# Altium schematic sheet Control_Board_Control.SchDoc
size A3
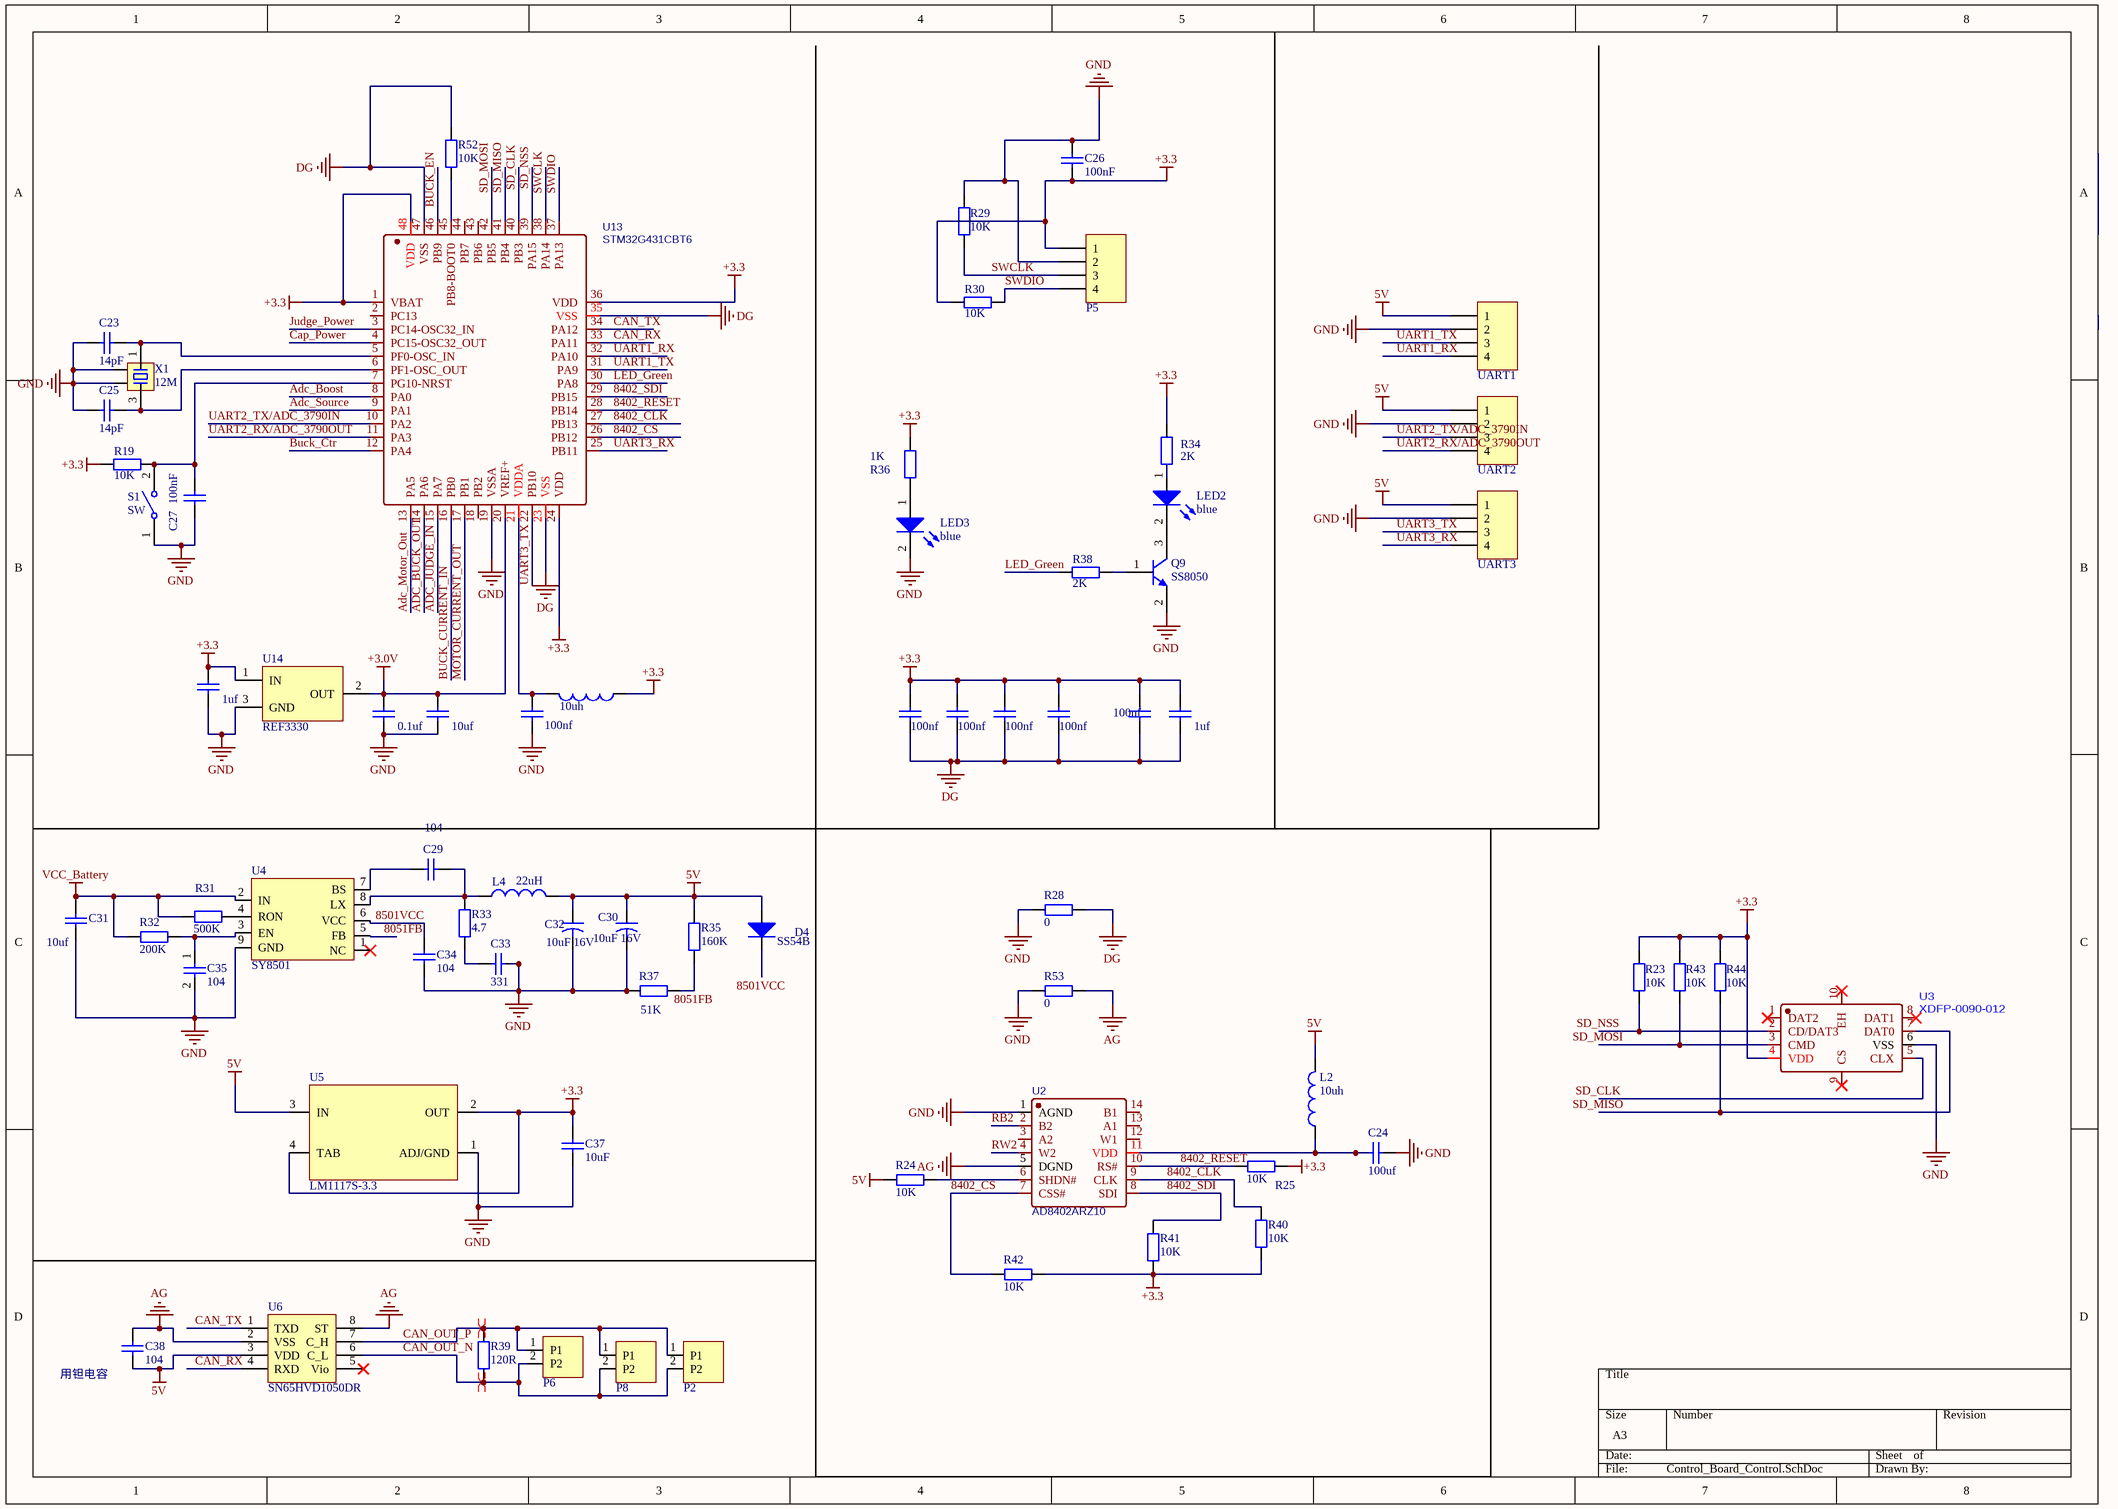
[diagram p0: Control_Board_Control.SchDoc]

## Parts
C23  value 14pF  [c0402]  (hidden comment: 27pf)
C24  100uf  [1210C]
C25  value 14pF  [c0402]  (hidden comment: 27pf)
C26  100nF  [r0402]
C27  100nf  [c0402]
C29  104  [r0402]
C30  10uF 16V  [3216]
C31  10uf  [0805-1C]
C32  10uF 16V  [3216]
C33  331  [r0402]
C34  104  [r0402]
C35  104  [r0402]
C36  100nf  [c0402]
C37  10UF  [3216]
C38  104  [r0402]
C52  100nf  [c0402]
C53  100nf  [c0402]
C54  100nf  [c0402]
C55  100nf  [c0402]
C56  100nf  [c0402]
C57  1uf  [c0402]
C58  1uf  [c0402]
C63  10uf  [c0402]
C65  0.1uf  [c0402]
D4  SS54B  [DO-214]
L2  10uh  [l0805]
L4  22uH  [CD54NP]
L8  10uh  [l0805]
LED2  COLOR: blue  [led0805]  (hidden comment: LED_灯_黄)
LED3  COLOR: blue  [led0805]  (hidden comment: LED_灯_黄)
P2  P2  [gh1.25]  (value not drawn)
P5  Header 4  [gh1.25 4p 立贴]  (value not drawn)
P6  P2  [gh1.25]  (value not drawn)
P8  P2  [gh1.25]  (value not drawn)
Q9  SS8050  [SOT-23]
R19  10k  [r0402]
R23  10K  [R0402]
R24  10K  [r0402]
R25  10K  [r0402]
R28  0  [r0402]
R29  10K  [r0402]
R30  10K  [r0402]
R31  500K  [r0402]
R32  200K  [r0402]
R33  4.7  [r0402]
R34  2K  [r0402]
R35  160K  [r0402]
R36  1K  [r0402]
R37  51K  [r0402]
R38  2K  [r0402]
R39  120R  [r0402]
R40  10K  [r0402]
R41  10K  [r0402]
R42  10K  [r0402]
R43  10K  [R0402]
R44  10K  [R0402]
R52  10K  [r0402]
R53  0  [r0402]
S1  SW  [KEY_SMD]
U2  AD8402ARZ10  [SOIC14]
U3  XDFP-0090-012  [SIM-SMD_LX_XDFP-0090-012]
U4  SY8501  [SO8E]
U5  LM1117S-3.3  [sot-223]
U6  SN65HVD1050DR  [LM358]
U13  STM32G431CBT6  [LQFP-48]
U14  REF3330  [sot23-3]
UART1  Header 4  [gh1.25 4p 立贴]  (value not drawn)
UART2  Header 4  [gh1.25 4p 立贴]  (value not drawn)
UART3  Header 4  [gh1.25 4p 立贴]  (value not drawn)
X1  12M  [XTAL-3225]

## Nets
5V: C30.1 C32.1 C38.2 D4.1(A) L2.2 L4.2 R24.2 R35.1 U5.3(IN) U6.3(VDD) UART1.1 UART2.1 UART3.1
+3.0V: C63.1 C65.1 U13.20(VREF+) U14.2(OUT)
+3.3: C26.2 C37.1 C52.1 C53.1 C54.1 C55.1 C56.1 C57.1 C58.1 L8.1 P5.1 R19.2 R23.2 R25.1 R30.1 R34.1 R36.2 R40.2 R41.2 R42.2 R43.2 R44.2 U3.4(VDD) U5.2(OUT) U5.4(TAB) U13.1(VBAT) U13.24(VDD) U13.36(VDD) U13.48(VDD) U14.1(IN)
AG: C38.1 R53.2 U2.5(DGND) U6.2(VSS) U6.8(ST)
DG: C52.2 C53.2 C54.2 C55.2 C56.2 C57.2 R28.2 R52.2 U13.23(VSS) U13.35(VSS) U13.47(VSS)
GND: C23.2 C24.1 C25.2 C26.1 C27.1 C30.2 C31.2 C32.2 C33.1 C34.2 C35.2 C36.2 C37.2 C58.2 C63.2 C65.2 LED3.2(K) P5.2 Q9.2(E) R28.1 R29.1 R37.1 R53.1 S1.1(COMMON) U2.1(AGND) U3.6(VSS) U4.9(GND) U5.1(ADJ/GND) U13.19(VSSA) U14.3(GND) UART1.2 UART2.2 UART3.2 X1.2 X1.4
VCC_Battery: C31.1 R31.2 R32.2 U4.2(IN)
8051FB: R35.2 R37.2 U4.5(FB)
8402_CLK: R40.1 U2.9(CLK) U13.27(PB13)
8402_CS: R42.1 U2.7(CSS#) U13.26(PB12)
8402_RESET: R25.2 U2.10(RS#) U13.28(PB14)
8402_SDI: R41.1 U2.8(SDI) U13.29(PB15)
8501VCC: C34.1 D4.2(K) U4.6(VCC)
Adc_Boost: U13.8(PA0)
ADC_BUCK_OUT: U13.14(PA6)
ADC_JUDGE_IN: U13.15(PA7)
Adc_Motor_Out: U13.13(PA5)
Adc_Source: U13.9(PA1)
Buck_Ctr: U13.12(PA4)
BUCK_CURRENT_IN: U13.16(PB0)
BUCK_EN: U13.46(PB9)
CAN_OUT_N: P2.2(P2) P6.2(P2) P8.2(P2) R39.1 U6.6(C_L)
CAN_OUT_P: P2.1(P1) P6.1(P1) P8.1(P1) R39.2 U6.7(C_H)
CAN_RX: U6.4(RXD) U13.33(PA11)
CAN_TX: U6.1(TXD) U13.34(PA12)
Cap_Power: U13.4(PC15-OSC32_OUT)
Judge_Power: U13.3(PC14-OSC32_IN)
LED_Green: R38.1 U13.30(PA8)
MOTOR_CURRENT_OUT: U13.17(PB1)
RB2: U2.2(B2)
RW2: U2.4(W2)
SD_CLK: U3.5(CLX) U13.40(PB3)
SD_MISO: R44.1 U3.7(DAT0) U13.41(PB4)
SD_MOSI: R43.1 U3.3(CMD) U13.42(PB5)
SD_NSS: R23.1 U3.2(CD/DAT3) U13.39(PA15)
SWCLK: P5.3 R29.2 U13.38(PA14)
SWDIO: P5.4 R30.2 U13.37(PA13)
UART1_RX: U13.32(PA10) UART1.4
UART1_TX: U13.31(PA9) UART1.3
UART2_RX/ADC_3790OUT: U13.11(PA3) UART2.4
UART2_TX/ADC_3790IN: U13.10(PA2) UART2.3
UART3_RX: U13.25(PB11) UART3.4
UART3_TX: U13.22(PB10) UART3.3
NetC23_1: C23.1 U13.5(PF0-OSC_IN) X1.1
NetC24_2: C24.2 L2.1 U2.11(VDD)
NetC25_1: C25.1 U13.6(PF1-OSC_OUT) X1.3
NetC27_2: C27.2 R19.1 S1.2(NO) U13.7(PG10-NRST)
NetC29_1: C29.1 L4.1 R33.1 U4.8(LX)
NetC29_2: C29.2 U4.7(BS)
NetC33_2: C33.2 R33.2
NetC35_1: C35.1 R32.1 U4.3(EN)
NetC36_1: C36.1 L8.2 U13.21(VDDA)
NetLED2_1: LED2.1(A) R34.2
NetLED2_2: LED2.2(K) Q9.3(C)
NetLED3_1: LED3.1(A) R36.1
NetQ9_1: Q9.1(B) R38.2
NetR24_1: R24.1 U2.6(SHDN#)
NetR31_1: R31.1 U4.4(RON)
NetR52_1: R52.1 U13.45(PB8-BOOT0)

Not connected (* = marked no-connect by the designer): U2 3(A2) 12(W1) 13(A1) 14(B1); U3 1(DAT2)* 8(DAT1)* 9(CS)* 10(EH)*; U4 1(NC)*; U6 5(Vio)*; U13 2(PC13) 18(PB2) 43(PB6) 44(PB7)

## Layout directives
differential pair: CAN_OUT_N, CAN_OUT_P

## Notes on the sheet
- (near C38) 用钽电容

## Library data of the parts
C23-C27 C29 C31 C33 C34 C37 = Cap: 无极性电容; Published: 8-Jun-2000; LatestRevisionDate: 17-Jul-2002; LatestRevisionNote: Re-released for DXP Platform.; PackageReference: RAD-0.3; Publisher: Altium Limited
  C24: Value: 100uf
  C26 C27: Value: 100nF
  C29 C34: Value: 104
  C31: Value: 10uf
  C33: Value: 331
  C37: Value: 10uF
C30 C32 = CAP2: 贴片电解; Value: 337; Published: 23-Sep-2002; PackageReference: CAPR5-4X5; Publisher: Altium Limited; PackageDescription: Capacitor; 2 Leads
C35 = CAP-W: 贴片电容1206; U: *; C: 104
C36 C52-C58 C63 C65 = Cap: 无极性电容; Value: 10nf; Published: 8-Jun-2000; LatestRevisionDate: 17-Jul-2002; LatestRevisionNote: Re-released for DXP Platform.; PackageReference: RAD-0.3; Publisher: Altium Limited
C38 = C: 贴片电容; BOM名称: 无极性贴片电容; 联系卖家，免费查找封装: 唯一出售店铺网址https://shop463601444.taobao.com; 封装库来自淘宝卖家ID：黄晶宝石: 其他店铺购入均为盗版假冒封装库，请立即申请退款
D4 = Diode: 肖特基二极管; Published: 8-Jun-2000; LatestRevisionDate: 17-Jul-2002; LatestRevisionNote: Re-released for DXP Platform.; PackageVersion: Sep-1996; PackageReference: SMC; Publisher: Altium Limited; PackageDescription: DO-214-AB/SMC; 2 C-Bend Leads; Body 7.9 x 5.9 mm, inc. leads (LxW); Code_JEDEC: DO-214-AB
L2 L4 L8 = Inductor: 功率电感; Code_IEC: 1005; Value: 47uH; Published: 8-Jun-2000; LatestRevisionDate: 29-May-2009; LatestRevisionNote: IPC-7351 Footprint Added.; PackageReference: 0402-A; Publisher: Altium Limited; PackageDescription: Chip Inductor; Code_JEITA: 0402
LED2 LED3 = LED: 贴片LED
P5 UART1-UART3 = Header 4: 排针; LatestRevisionDate: 17-Jul-2002; LatestRevisionNote: Re-released for DXP Platform.; Publisher: Altium Limited
Q9 = SS8050: NPN贴片三极管; Published: 8-Jun-2000; LatestRevisionDate: 15-Jan-2003; LatestRevisionNote: PCB Footprint 'BCY-W3/D4.7' replaced; DatasheetDocument: 1997; PackageDocument: Sep-1998; PackageReference: TO-92A; Publisher: Altium Limited; Code_JEDEC: TO-92A; ComponentLink1Description: Manufacturer Link; ComponentLink1URL: http://www.fairchildsemi.com/; ComponentLink2Description: Datasheet; ComponentLink2URL: http://www.fairchildsemi.com/ds/2N%2F2N3904.pdf
R19 R23 R29 R30 R34 R36 R38 R43 R44 = Res1: 贴片电阻; Published: 8-Jun-2000; LatestRevisionDate: 17-Jul-2002; LatestRevisionNote: Re-released for DXP Platform.; PackageReference: AXIAL-0.4; Publisher: Altium Limited
  R19 R23 R29 R30 R43 R44: Value: 10K
  R34 R38: Value: 2K
  R36: Value: 1K
R24 R25 R28 R31-R33 R35 R37 R39-R42 R52 R53 = R: 贴片电阻; 联系卖家，免费查找封装: 唯一出售店铺网址https://shop463601444.taobao.com; 封装库来自淘宝卖家ID：黄晶宝石: 其他店铺购入均为盗版假冒封装库，请立即申请退款; BOM名称: 贴片电阻
U2 = AD8402ARZ100: BOM_Manufacturer: ADI(亚德诺)/LINEAR; Contributor: LCSC; BOM_Supplier: LCSC; BOM_Supplier Part: C652776; BOM_Manufacturer Part: AD8402ARZ100; spicePre: U; spiceSymbolName: AD8402ARZ100
U4 = SY8501: 电源管理芯片
U6 = TLP250
U13 = STM32G431CBT6: BOM_Manufacturer: STMicroelectronics; Contributor: LCSC; BOM_Supplier: LCSC; BOM_Supplier Part: C529355; BOM_Manufacturer Part: STM32G431CBT6; BOM_JLCPCB Part Class: Extended Part; spicePre: U; spiceSymbolName: STM32G431CBT6
U14 = REF33
X1 = XTAL-4P: 4脚无源晶振